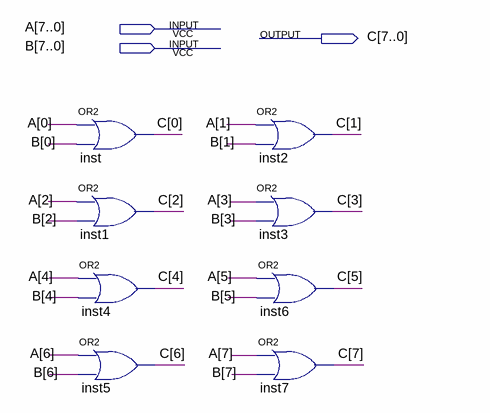
[diagram p0: schematic sheet]
// Quartus schematic OR2x8.bdf as structural Verilog: 8 symbols, 3 pins
module OR2x8 (
  input  [7:0] A,
  input  [7:0] B,
  output [7:0] C
);

  or inst (C[0], A[0], B[0]);
  or inst1 (C[2], A[2], B[2]);
  or inst4 (C[4], A[4], B[4]);
  or inst5 (C[6], A[6], B[6]);
  or inst2 (C[1], A[1], B[1]);
  or inst3 (C[3], A[3], B[3]);
  or inst6 (C[5], A[5], B[5]);
  or inst7 (C[7], A[7], B[7]);
endmodule
